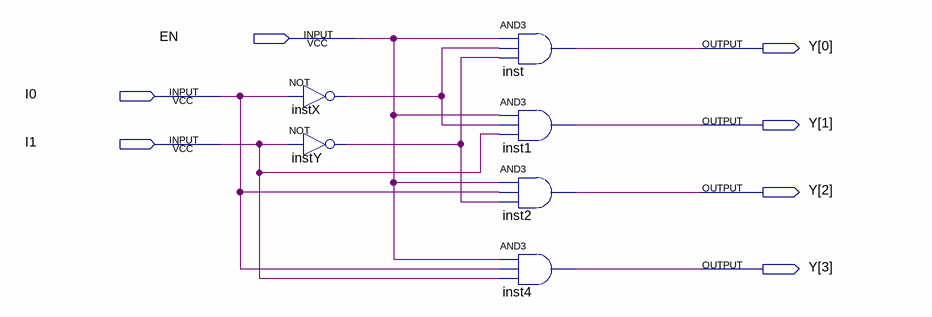
[diagram p0: schematic sheet]
// Quartus schematic DECODER2_4.bdf as structural Verilog: 6 symbols, 7 pins
module DECODER2_4 (
  input  EN,
  input  I0,
  input  I1,
  output [3:0] Y
);

  wire instX_out, instY_out;

  not instX (instX_out, I0);
  not instY (instY_out, I1);
  and inst (Y[0], EN, instX_out, instY_out);
  and inst1 (Y[1], EN, instX_out, I1);
  and inst2 (Y[2], EN, I0, instY_out);
  and inst4 (Y[3], EN, I0, I1);
endmodule
